# Altium schematic sheet main.SchDoc
size A; SheetNumber: 1; SheetTotal: 1
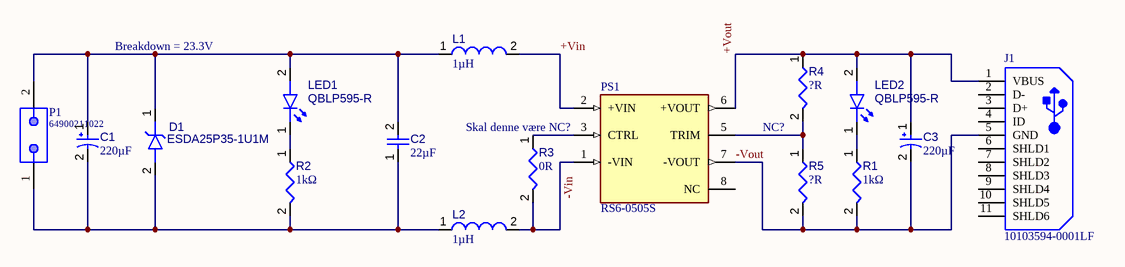
[diagram p0: main.SchDoc]

## Parts
C1  value 220µF  [CAPPR65-500-1250X1000X1350]  (hidden comment: ECA-1HM221)
C2  value 22µF  [CAPC0805(2012)145_L]  (hidden comment: Capacitor 22µF +/-40% 16V 0805)
C3  value 220µF  [CAPPR65-500-1250X1000X1350]  (hidden comment: ECA-1HM221)
D1  ESDA25P35-1U1M  [STM-QFN1610]
J1  10103594-0001LF  [FCI-10103594-0001LF_V]
L1  value 1µH  [INDC2520X120X60ML20T20]  (hidden comment: LQM2HPN1R0MJ0L)
L2  value 1µH  [INDC2520X120X60ML20T20]  (hidden comment: LQM2HPN1R0MJ0L)
LED1  QBLP595-R  [QTB-QBLP595_V]
LED2  QBLP595-R  [QTB-QBLP595_V]
P1  64900211022  [66200221022]
PS1  RS6-0505S  [CONV_RS6-0505S]
R1  value 1kΩ  [RESC0805(2012)_L]  (hidden comment: 1KR5J)
R2  value 1kΩ  [RESC0805(2012)_L]  (hidden comment: 1KR5J)
R3  value 0R  [RESC0805(2012)_L]  (hidden comment: 0R 0805)
R4  value ?R  [RESC0805(2012)_L]  (hidden comment: 0R 0805)
R5  value ?R  [RESC0805(2012)_L]  (hidden comment: 0R 0805)

## Nets
+Vin: L1.2 PS1.2(+VIN)
+Vout: C3.1 J1.1(VBUS) LED2.2(A) PS1.6(+VOUT) R4.1
-Vin: L2.2 PS1.1(-VIN) R3.2
-Vout: C3.2 J1.5(GND) PS1.7(-VOUT) R1.2 R5.2
NetC1_1: C1.1 C2.2 D1.1(A) L1.1 LED1.2(A) P1.2
NetC1_2: C1.2 C2.1 D1.2(A) L2.1 P1.1 R2.2
NetLED1_1: LED1.1(K) R2.1
NetLED2_1: LED2.1(K) R1.1
NetPS1_3: PS1.3(CTRL) R3.1
NetPS1_5: PS1.5(TRIM) R4.2 R5.1

Not connected (* = marked no-connect by the designer): J1 2(D-) 3(D+) 4(ID) 6(SHLD1) 7(SHLD2) 8(SHLD3) 9(SHLD4) 10(SHLD5) 11(SHLD6); PS1 8(NC)

## Notes on the sheet
- Breakdown = 23.3V
- Skal denne være NC?
- NC?

## Library data of the parts
C1 C3 = CMP-001-00028-5: Aluminum Electrolytic Capacitor, 220 uF, +/- 20%, 50 V, -40 to 85 degC, 2-Pin THD, RoHS, Bulk; Manufacturer: Panasonic; Ripple Current: 400mA; Voltage Rating: 50V; Pins: 2; Case/Package: Radial; Package Quantity: 200; Datasheet URL: http://industrial.panasonic.com/cdbs/www-data/pdf/RDF0000/DMF0000COL68.pdf; Diameter: 10mm; Min Operating Temperature: -40°C; Ripple Current (AC): 400mA; Lead Pitch: 5mm; Packaging: Bulk; Datasheet Version: Mar-16; Tolerance: 20%; Manufacturer URL: http://www.panasonic.com/; Package Description: 2-Pin Radial Lead, Dia 10 mm, Body Length 12.5 mm; Max Operating Temperature: 85°C; Package Reference: CAPPR65-500-1250X1000X1350; RoHS Compliant: True; Capacitor Type: Electrolytic; Mounting Technology: TH
C2 = CMP-001-00081-2: Chip Capacitor, 22µF +/-40%, 16V, 0805, Thickness 1.45 mm; Tolerance: 5%; Min Operating Temperature: -55°C; Mounting Technology: SMT; Case/Package: 0402; Pins: 2; Voltage Rating: 16V; Max Operating Temperature: 85°C
D1 = CMP-004-00023-2: TVS DIODE 22V 41V 1610; Max Surge Current: 35A; Peak Inverse Voltage: 23.3V; RoHS Compliant: Yes; Mounting Technology: SMT; Pins: 2; Case/Package: QFN1610 (0603)
J1 = CMP-002-00038-1: Micro USB 2.0 B Receptacle, 5 Position, Height 3.24 mm, -55 to 85 degC, RoHS, Tape and Reel; Manufacturer: FCI Electronics; Voltage Rating: 100V; Gender: Female; Current Rating: 1.8A; Min Operating Temperature: -55°C; Pins: 5; Contact Plating: Gold; Package Description: 5-Pin Surface Mount Device, Body 8.04 x 5.62 mm; RoHS Compliant: True; Lead Pitch: 0.65mm; Packaging: TapeandReel; Case/Package: FCI-10103594-0001LF; Manufacturer URL: http://portal.fciconnect.com/; Mounting Technology: SM; Datasheet Version: Rev. A, 06/2010; Connector Type: USB; Contact Material: Copper; Datasheet URL: http://portal.fciconnect.com/Comergent//fci/drawing/10103594.pdf; Max Operating Temperature: 85°C; Package Quantity: 1500; Package Reference: FCI-10103594-0001LF
L1 L2 = CMP-006-00008-4: Chip Inductor, 1 uH, +/- 20%, 1 MHz, -55 to 125 degC, 1008 (2520 Metric), RoHS, Tape and Reel; Manufacturer: Murata; Shielding: Shielded; Core Material: Ferrite; Self Resonant Frequency: 70MHz; Current Rating: 1.5A; Resistance: 0.09Ohm; Datasheet URL: http://psearch.en.murata.com/inductor/product/LQM2HPN1R0MJ0%23.pdf; RoHS Compliant: True; Package Reference: 1008; Tolerance: 20%; Case/Package: 1008; Packaging: TapeandReel; Datasheet Version: Aug-16; Min Operating Temperature: -40°C; Package Quantity: 3000; Package Description: 2-Pin Surface Mount Device, Body 2.5 x 2 mm; Max Operating Temperature: 85°C; Mounting Technology: SM
LED1 LED2 = CMP-007-00040-2: Chip LED 0402, Red, 0.02 A, 2.0 to 2.5 V, -40 to 80 degC, 2-Pin SMD, RoHS, Tape and Reel; Colour: Red; Case/Package: 0402; RoHS Compliant: Yes; Pins: 2; Mounting Technology: SMT
P1 = 66200221022: THT Male Header WR-MPC3, with Snap-in Plastic Pegs, Right Angled, Dual Row, pitch 3 mm, 2 pins; Pitch: 3 mm; Working Voltage: 250 VAC; Contact Resistance: 10 mOhm; Pin Number: 2; ComponentLink1Description: Manufacturer; ComponentLink1URL: http://www.we-online.de; ComponentLink2Description: Datasheet; ComponentLink2URL: https://katalog.we-online.de/em/datasheet/6620xx21022.pdf; Part Number: 66200221022; Published Date: September 2018; Publisher: Wurth Elektronik; Operating Temperature: -40 to 105 degC; Packaging: Tube; Gender: Male; Mounting Technology: THT; Orientation: Right Angled
PS1 = RS6-0505S: 6 Watt SIP8 Single and Dual Output; Package: None; Price: None; Value: *; MP: RS6-0505S; Availability: Unavailable
R1 R2 = CMP-009-00076-1: 1K 0.125W 5% 0805 (2012 Metric)  SMD; Mounting Technology: SMT; Power: 0.125W; Pins: 2; Case/Package: 0805; Tolerance: 5%
R3-R5 = CMP-009-00076-1: 0R 0805 (2012 Metric)  SMD; Power: 0.125W; Tolerance: 5%; Mounting Technology: SMT; Pins: 2; Case/Package: 0805